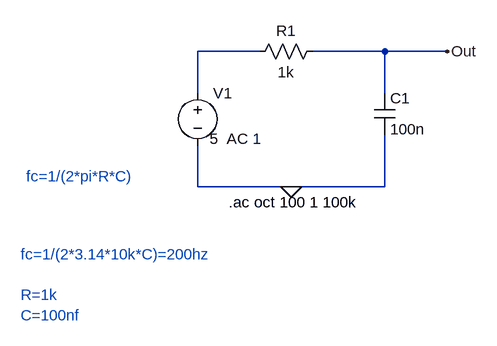
[diagram p0: schematic Draft1.asc]
Draft1.asc, the LTspice schematic file:
Version 4.1
SHEET 1 880 680
WIRE 448 32 352 32
WIRE 640 32 528 32
WIRE 736 32 640 32
WIRE 352 96 352 32
WIRE 640 96 640 32
WIRE 352 240 352 176
WIRE 496 240 352 240
WIRE 640 240 640 160
WIRE 640 240 496 240
FLAG 496 240 0
FLAG 736 32 Out
SYMBOL res 544 16 R90
WINDOW 0 0 56 VBottom 2
WINDOW 3 32 56 VTop 2
SYMATTR InstName R1
SYMATTR Value 1k
SYMBOL cap 624 96 R0
SYMATTR InstName C1
SYMATTR Value 100n
SYMBOL voltage 352 80 R0
WINDOW 3 19 86 Left 2
WINDOW 123 45 86 Left 2
WINDOW 39 0 0 Left 0
SYMATTR Value 5
SYMATTR Value2 AC 1
SYMATTR InstName V1
TEXT 88 224 Left 2 ;fc=1/(2*pi*R*C)
TEXT 80 344 Left 2 ;fc=1/(2*3.14*10k*C)=200hz\n \nR=1k\nC=100nf
TEXT 400 264 Left 2 !.ac oct 100 1 100k

The netlist it stands for:
* Draft1.asc
R1 Out N001 1k
C1 Out 0 100n
V1 N001 0 5 AC 1
* fc=1/(2*pi*R*C)
* fc=1/(2*3.14*10k*C)=200hz
* R=1k
* C=100nf
.ac oct 100 1 100k
.backanno
.end

* Results of the author's LTspice run, read from the files saved beside the schematic
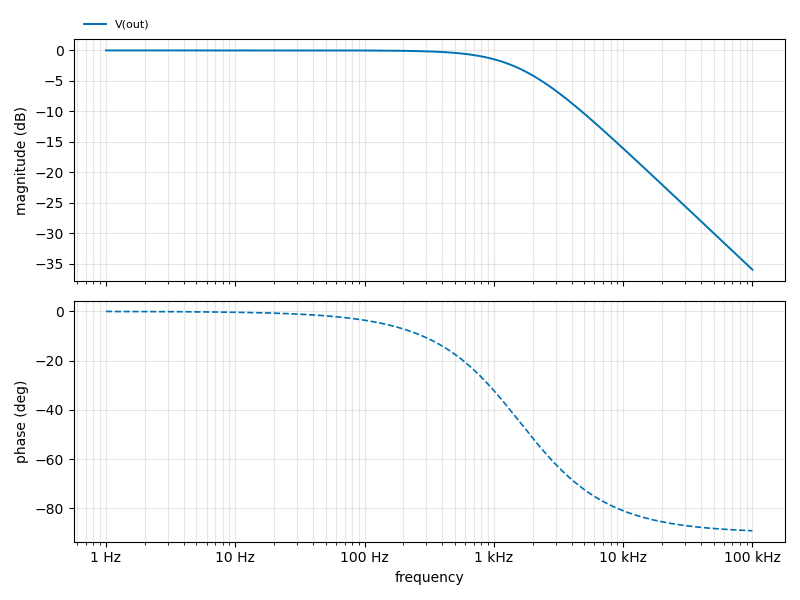
[diagram p1: AC Analysis of Draft1.asc, plotted from the saved traces]
* AC Analysis, 1 run:
*   V(out): -0.00 dB at 1 Hz, -35.96 dB at 100 kHz, peak -0.00 dB at 1 Hz, 3 dB below the peak at 1.592 kHz